# Altium project hardwarev2.PrjPcb
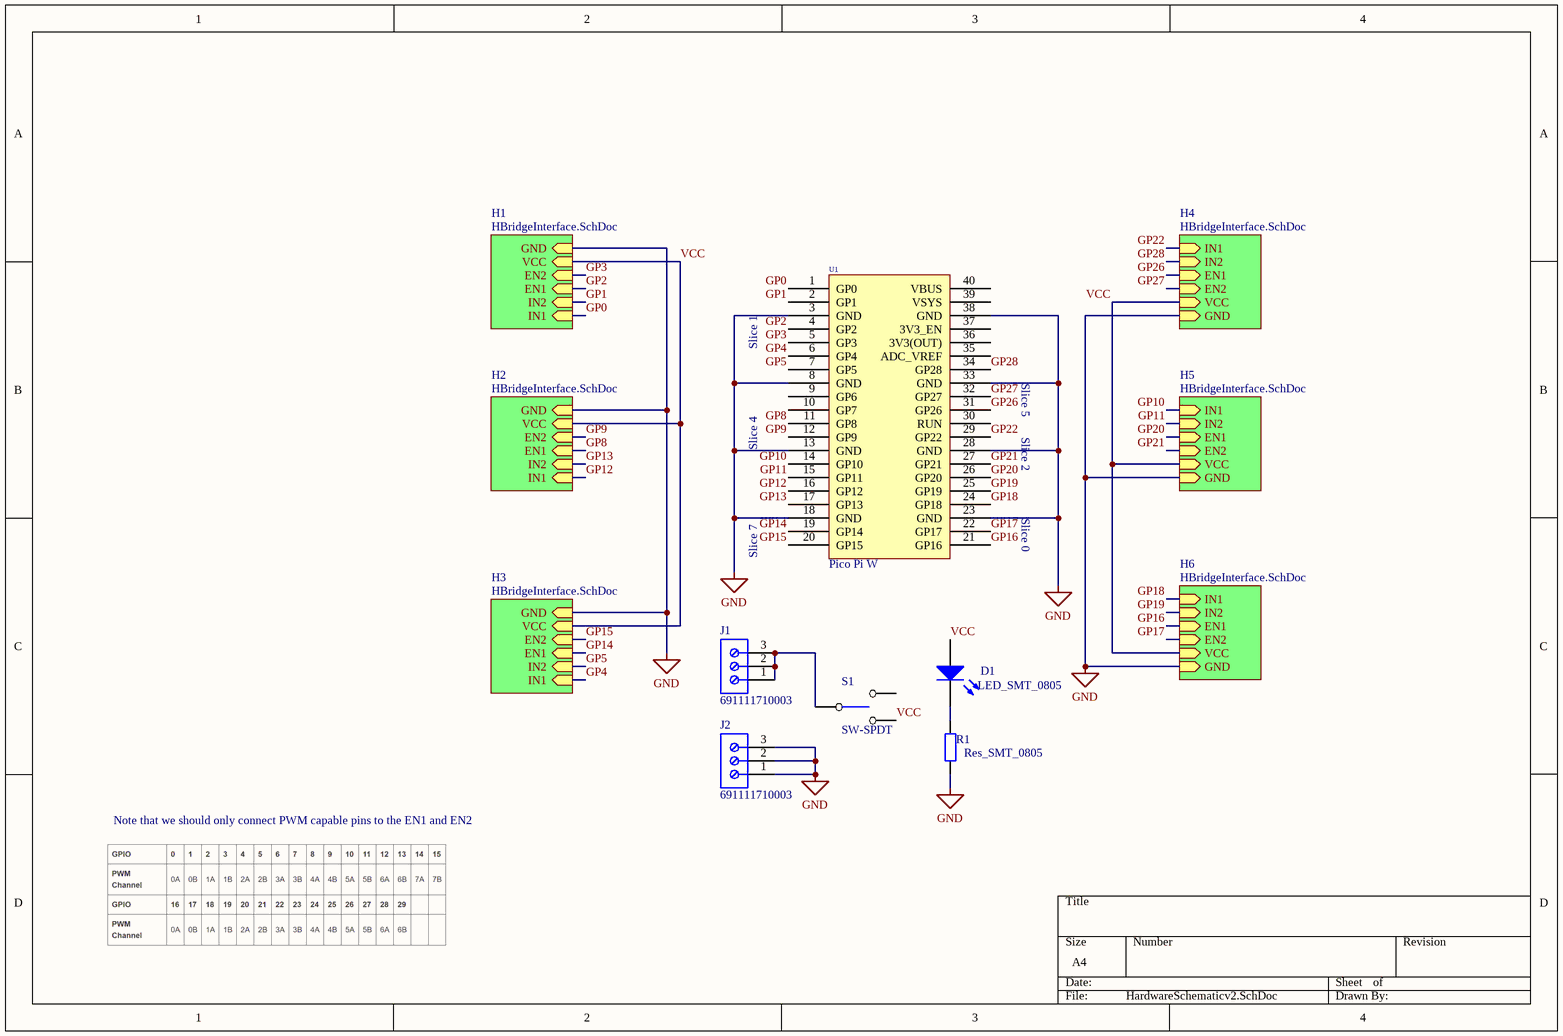
[diagram p0: HardwareSchematicv2.SchDoc]
2 sheets, 18 parts. Net scope: hierarchical (ports join the sheet entries above them; power ports are global).
Board file: hardware.PcbDoc
Sheets:
  HardwareSchematicv2.SchDoc
    H1 = HBridgeInterface.SchDoc
    H2 = HBridgeInterface.SchDoc
    H3 = HBridgeInterface.SchDoc
    H4 = HBridgeInterface.SchDoc
    H5 = HBridgeInterface.SchDoc
    H6 = HBridgeInterface.SchDoc

## Sheet HardwareSchematicv2.SchDoc
size A4; SheetNumber: 1; SheetTotal: 2

### Parts
D1  LED_SMT_0805  [0805 LED]
J1  691111710003  [691111710003]
J2  691111710003  [691111710003]
R1  Res_SMT_0805  [0805 RES]
S1  SW-SPDT  [SW-SPDT]
U1  Pico Pi W  [New footprint 1]

### Sub-sheets
H1 = HBridgeInterface.SchDoc: IN1 (in), IN2 (in), EN1 (in), EN2 (in), VCC (in), GND (in)
H2 = HBridgeInterface.SchDoc: IN1 (in), IN2 (in), EN1 (in), EN2 (in), VCC (in), GND (in)
H3 = HBridgeInterface.SchDoc: IN1 (in), IN2 (in), EN1 (in), EN2 (in), VCC (in), GND (in)
H4 = HBridgeInterface.SchDoc: IN1 (in), IN2 (in), EN1 (in), EN2 (in), VCC (in), GND (in)
H5 = HBridgeInterface.SchDoc: IN1 (in), IN2 (in), EN1 (in), EN2 (in), VCC (in), GND (in)
H6 = HBridgeInterface.SchDoc: IN1 (in), IN2 (in), EN1 (in), EN2 (in), VCC (in), GND (in)

### Nets
GND: J2.1 J2.2 J2.3 R1.2 U1.3(GND) U1.8(GND) U1.13(GND) U1.18(GND) U1.23(GND) U1.28(GND) U1.33(GND) U1.38(GND) ; sheet H1/GND, sheet H2/GND, sheet H3/GND, sheet H4/GND, sheet H5/GND, sheet H6/GND
GP0: U1.1(GP0) ; sheet H1/IN1
GP1: U1.2(GP1) ; sheet H1/IN2
GP2: U1.4(GP2) ; sheet H1/EN1
GP3: U1.5(GP3) ; sheet H1/EN2
GP4: U1.6(GP4) ; sheet H3/IN1
GP5: U1.7(GP5) ; sheet H3/IN2
GP8: U1.11(GP8) ; sheet H2/EN1
GP9: U1.12(GP9) ; sheet H2/EN2
GP10: U1.14(GP10) ; sheet H5/IN1
GP11: U1.15(GP11) ; sheet H5/IN2
GP12: U1.16(GP12) ; sheet H2/IN1
GP13: U1.17(GP13) ; sheet H2/IN2
GP14: U1.19(GP14) ; sheet H3/EN1
GP15: U1.20(GP15) ; sheet H3/EN2
GP16: U1.21(GP16) ; sheet H6/EN1
GP17: U1.22(GP17) ; sheet H6/EN2
GP18: U1.24(GP18) ; sheet H6/IN1
GP19: U1.25(GP19) ; sheet H6/IN2
GP20: U1.26(GP20) ; sheet H5/EN1
GP21: U1.27(GP21) ; sheet H5/EN2
GP22: U1.29(GP22) ; sheet H4/IN1
GP26: U1.31(GP26) ; sheet H4/EN1
GP27: U1.32(GP27) ; sheet H4/EN2
GP28: U1.34(GP28) ; sheet H4/IN2
VCC: D1.1(A) S1.3 ; sheet H1/VCC, sheet H2/VCC, sheet H3/VCC, sheet H4/VCC, sheet H5/VCC, sheet H6/VCC
NetD1_2: D1.2(K) R1.1
NetJ1_1: J1.1 J1.2 J1.3 S1.2

Not connected (* = marked no-connect by the designer): S1 1; U1 9(GP6) 10(GP7) 30(RUN) 35(ADC_VREF) 36(3V3(OUT)) 37(3V3_EN) 39(VSYS) 40(VBUS)

### Notes on the sheet
- Slice 1
- Slice 5
- Slice 4
- Slice 2
- Slice 0
- Slice 7
- Note that we should only connect PWM capable pins to the EN1 and EN2

### Library data of the parts
D1 = CMP-016-000004-1: SMT LED 0805 size; Manufacturer Part Number: LTST-C170KGKT; Manufacturer: Lite-On Inc.; Wavelength - Dominant: 571nm; Viewing Angle: 130°; Lens Transparency: Clear; Lens Color: Colorless; Lens Style/Size: Rectangle with Flat Top, 1.40mm x 1.25mm; Millicandela Rating: 35mcd; Voltage - Forward (Vf) (Typ): 2V; Wavelength - Peak: 574nm; Current - Test: 20mA; Color: Green; Design Item ID: LED_SMT_0805; Height (Max): 1.10mm; Mounting Type: Surface Mount; Package / Case: 0805 (2012 Metric); ComponentLink1URL: http://optoelectronics.liteon.com/upload/download/DS22-2000-073/LTST-C170KGKT.pdf; Category: Optoelectronics; Component Type: Standard; Pricing 1: 1=0.62, 10=0.459, 25=0.338, 100=0.2415, 250=0.16416, 500=0.14486, 1000=0.11347 (NZD); Packaging: Cut Tape (CT); Stock 1: 503069; ComponentLink1Description: http://optoelectronics.liteon.com/upload/download/DS22-2000-073/LTST-C170KGKT.pdf; Source: EE209_SchLib.SchLib; Features: -; Part Status: Active; Size / Dimension: 2.00mm L x 1.25mm W; Pin Count: 2; RoHS: RoHS Compliant
J1 J2 = CMP-1502-03263-2: NexarPartId: 8917709; Wire/Cable Gauge: 26AWG; Wire Gauge (Min): 14AWG; Plating: Steel; Pitch: 5.0038mm; Current: 8A; Number of Positions Per Level: 3; Number of Levels: 1; Voltage Rating: 300V; Stripping Length: -6mm; Length: 7.6mm; Lead Pitch: 5mm; Color: Green; Termination: Screw; Wire Gauge (Max): 26AWG; Max Operating Temperature: 105°C; RoHS: Compliant; Width: 16.2mm; REACH SVHC: Unknown; Current Rating: 8A; Packaging: Box; Contact Material: Brass; Contact Plating: Tin; Number of Contacts: 3; Voltage: 300V; Height: 14mm; Number of Pins: 3; Mount: Through Hole; Min Operating Temperature: -40°C; Housing Material: Nylon
R1 = CMP-019-000000-1: 0805 resistor; LatestRevisionDate: 17-Jul-2002; Source: EE209_SchLib.SchLib; Publisher: Altium Limited; Component Type: Standard; Value: *; Pin Count: 2; Design Item ID: Res_SMT_0805; PackageReference: AXIAL-0.4; LatestRevisionNote: Re-released for DXP Platform.; Published: 8-Jun-2000
S1 = CMP-025-000001-1: Toggle Switch; Source: COMSYS301.SCHLIB; Pin Count: 3; Component Type: Standard; Design Item ID: SW-SPDT
U1 = Pico-Pi-W-1: micro

## Sheet HBridgeInterface.SchDoc
size A4; SheetNumber: 2; SheetTotal: 2
Used 6 times, as channels H1, H2, H3, H4, H5, H6. Parts and nets are listed once, with the designators drawn on the sheet.
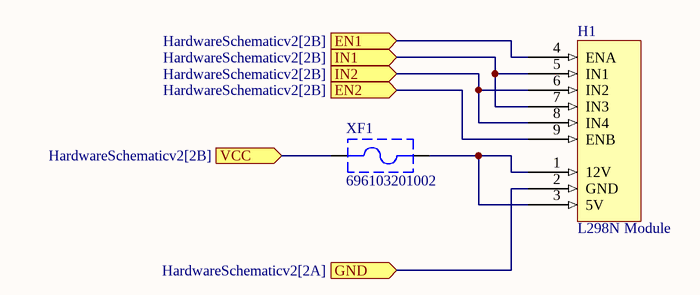
[diagram p1: HBridgeInterface.SchDoc]

### Parts
H1  L298N Module  [New footprint 1]
XF1  696103201002  [696103201002]

### Ports
EN1 (in, see HardwareSchematicv2[2B]), EN2 (in, see HardwareSchematicv2[2B]), GND (in, see HardwareSchematicv2[2A]), IN1 (in, see HardwareSchematicv2[2B]), IN2 (in, see HardwareSchematicv2[2B]), VCC (in, see HardwareSchematicv2[2B])

### Nets
EN1: H1.4(ENA) ; port EN1
EN2: H1.9(ENB) ; port EN2
GND: H1.2(GND) ; port GND
IN1: H1.5(IN1) H1.7(IN3) ; port IN1
IN2: H1.6(IN2) H1.8(IN4) ; port IN2
VCC: XF1.1 ; port VCC
NetH1_1: H1.1(12V) H1.3(5V) XF1.2

### Channels
H1: designators end in _H1; ports EN1=GP2 EN2=GP3 GND=GND IN1=GP0 IN2=GP1 VCC=VCC
H2: designators end in _H2; ports EN1=GP8 EN2=GP9 GND=GND IN1=GP12 IN2=GP13 VCC=VCC
H3: designators end in _H3; ports EN1=GP14 EN2=GP15 GND=GND IN1=GP4 IN2=GP5 VCC=VCC
H4: designators end in _H4; ports EN1=GP26 EN2=GP27 GND=GND IN1=GP22 IN2=GP28 VCC=VCC
H5: designators end in _H5; ports EN1=GP20 EN2=GP21 GND=GND IN1=GP10 IN2=GP11 VCC=VCC
H6: designators end in _H6; ports EN1=GP16 EN2=GP17 GND=GND IN1=GP18 IN2=GP19 VCC=VCC

### Library data of the parts
H1 = L298N_Board-2: Direct conector for H-Bridge
XF1 = CMP-1502-00239-2: NexarPartId: 82221271; Packaging: Box; RoHS: Non-Compliant

## Nets that join several sheets
GND: HardwareSchematicv2 (12 pins), H1 (H1_H1.2), H2 (H1_H2.2), H3 (H1_H3.2), H4 (H1_H4.2), H5 (H1_H5.2), H6 (H1_H6.2)
GP0: HardwareSchematicv2 (U1.1), H1 (H1_H1.5 H1_H1.7)
GP1: HardwareSchematicv2 (U1.2), H1 (H1_H1.6 H1_H1.8)
GP2: HardwareSchematicv2 (U1.4), H1 (H1_H1.4)
GP3: HardwareSchematicv2 (U1.5), H1 (H1_H1.9)
GP4: HardwareSchematicv2 (U1.6), H3 (H1_H3.5 H1_H3.7)
GP5: HardwareSchematicv2 (U1.7), H3 (H1_H3.6 H1_H3.8)
GP8: HardwareSchematicv2 (U1.11), H2 (H1_H2.4)
GP9: HardwareSchematicv2 (U1.12), H2 (H1_H2.9)
GP10: HardwareSchematicv2 (U1.14), H5 (H1_H5.5 H1_H5.7)
GP11: HardwareSchematicv2 (U1.15), H5 (H1_H5.6 H1_H5.8)
GP12: HardwareSchematicv2 (U1.16), H2 (H1_H2.5 H1_H2.7)
GP13: HardwareSchematicv2 (U1.17), H2 (H1_H2.6 H1_H2.8)
GP14: HardwareSchematicv2 (U1.19), H3 (H1_H3.4)
GP15: HardwareSchematicv2 (U1.20), H3 (H1_H3.9)
GP16: HardwareSchematicv2 (U1.21), H6 (H1_H6.4)
GP17: HardwareSchematicv2 (U1.22), H6 (H1_H6.9)
GP18: HardwareSchematicv2 (U1.24), H6 (H1_H6.5 H1_H6.7)
GP19: HardwareSchematicv2 (U1.25), H6 (H1_H6.6 H1_H6.8)
GP20: HardwareSchematicv2 (U1.26), H5 (H1_H5.4)
GP21: HardwareSchematicv2 (U1.27), H5 (H1_H5.9)
GP22: HardwareSchematicv2 (U1.29), H4 (H1_H4.5 H1_H4.7)
GP26: HardwareSchematicv2 (U1.31), H4 (H1_H4.4)
GP27: HardwareSchematicv2 (U1.32), H4 (H1_H4.9)
GP28: HardwareSchematicv2 (U1.34), H4 (H1_H4.6 H1_H4.8)
VCC: HardwareSchematicv2 (D1.1 S1.3), H1 (XF1_H1.1), H2 (XF1_H2.1), H3 (XF1_H3.1), H4 (XF1_H4.1), H5 (XF1_H5.1), H6 (XF1_H6.1)